# EAGLE design DigPSU1 (EAGLE 5.07)
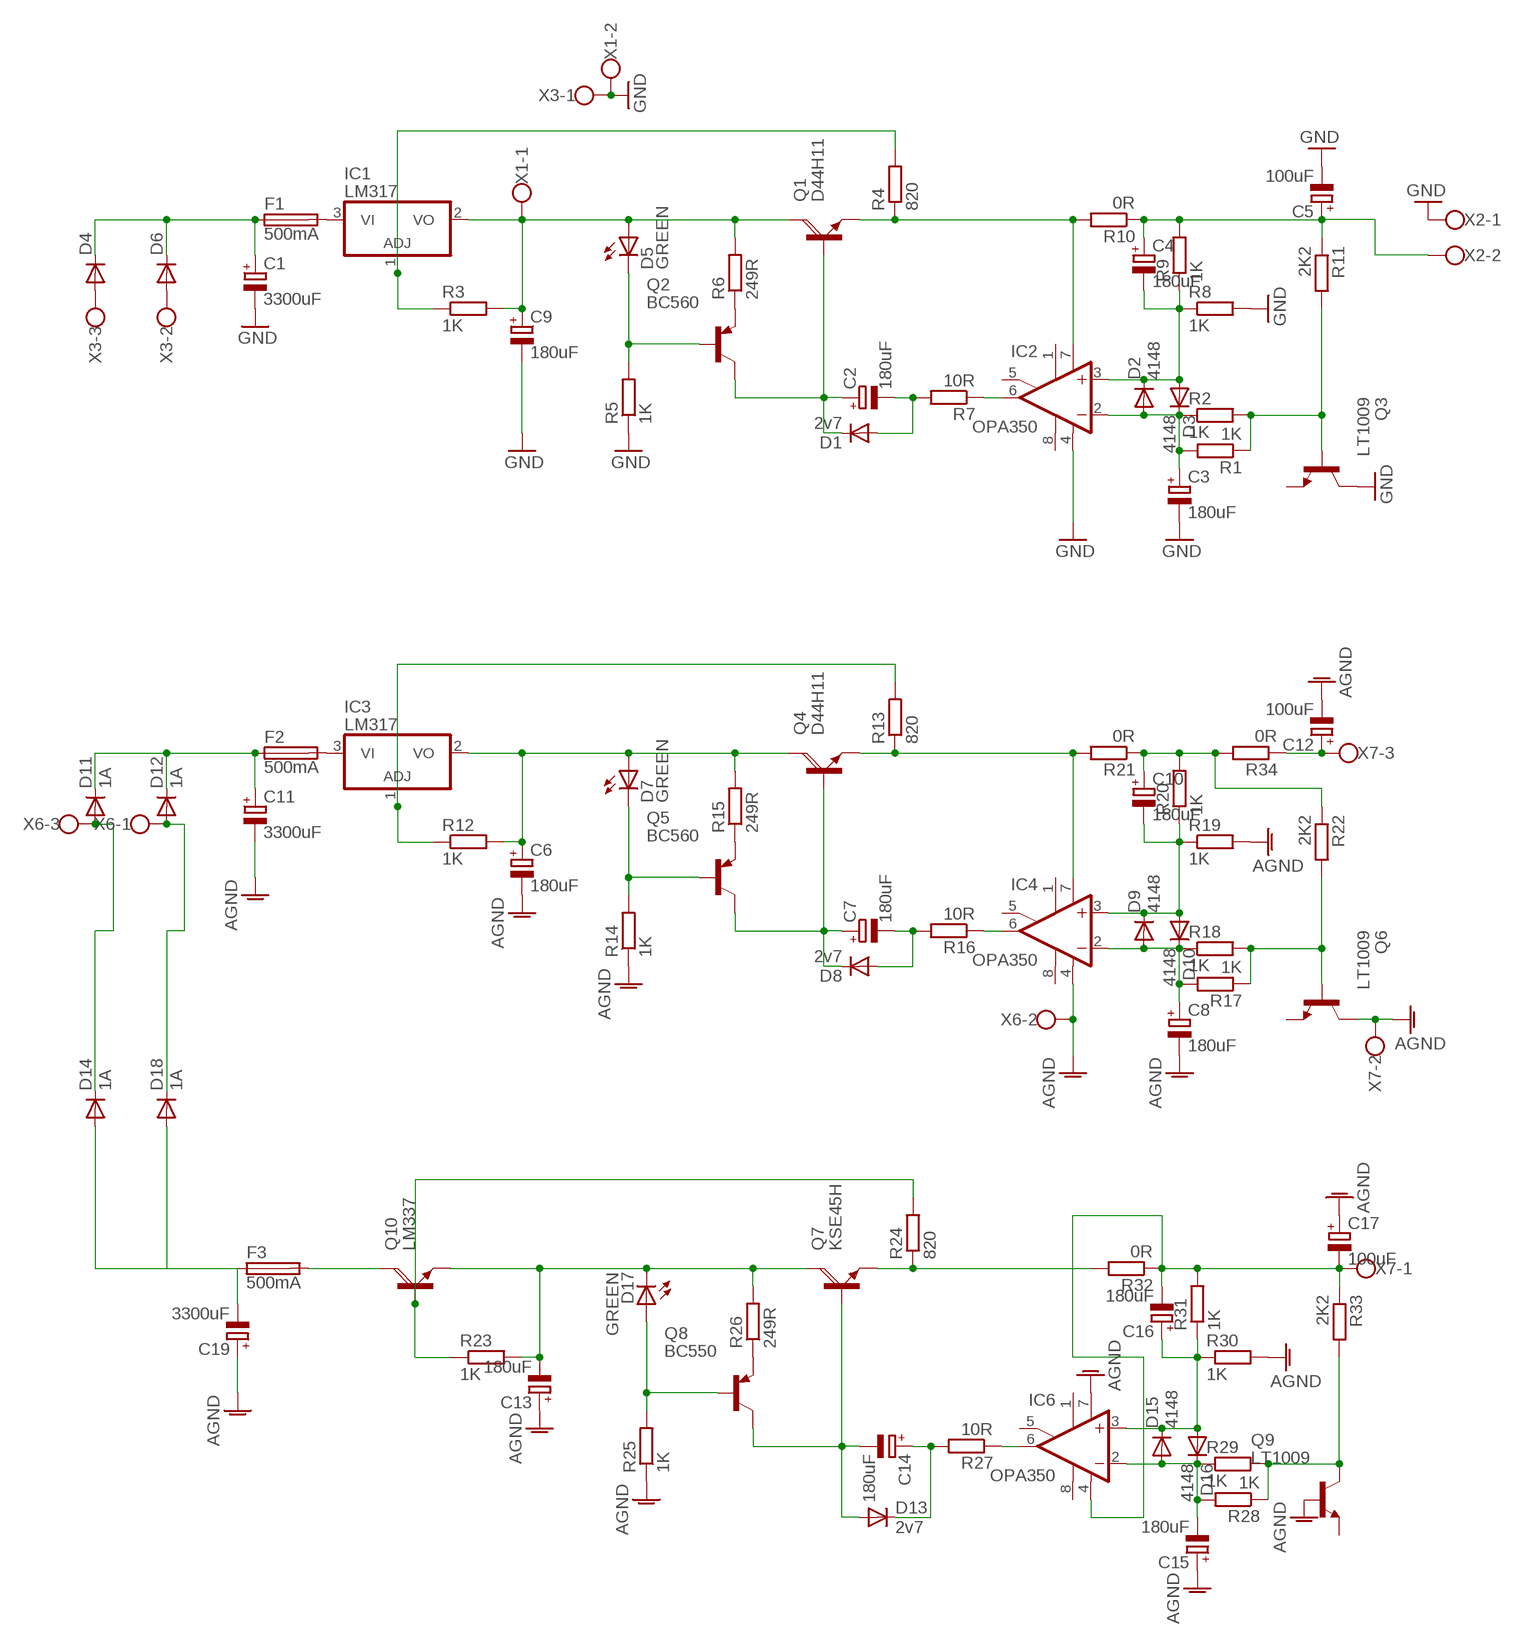
[diagram p0: schematic, sheet 1]

## Parts
C1  3300uF  CPOL-EUE7.5-16  [E7,5-16]
C2  180uF  CPOL-EUE3.5-8  [E3,5-8]
C3  180uF  CPOL-EUE3.5-8  [E3,5-8]
C4  180uF  CPOL-EUE3.5-8  [E3,5-8]
C5  100uF  CPOL-EUE5-10.5  [E5-10,5]
C6  180uF  CPOL-EUE3.5-8  [E3,5-8]
C7  180uF  CPOL-EUE3.5-8  [E3,5-8]
C8  180uF  CPOL-EUE3.5-8  [E3,5-8]
C9  180uF  CPOL-EUE3.5-8  [E3,5-8]
C10  180uF  CPOL-EUE3.5-8  [E3,5-8]
C11  3300uF  CPOL-EUE7.5-16  [E7,5-16]
C12  100uF  CPOL-EUE5-10.5  [E5-10,5]
C13  180uF  CPOL-EUE3.5-8  [E3,5-8]
C14  180uF  CPOL-EUE3.5-8  [E3,5-8]
C15  180uF  CPOL-EUE3.5-8  [E3,5-8]
C16  180uF  CPOL-EUE3.5-8  [E3,5-8]
C17  100uF  CPOL-EUE5-10.5  [E5-10,5]
C19  3300uF  CPOL-EUE7.5-16  [E7,5-16]
D1  2v7  1N4148DO35-7  [DO35-7]
D2  4148  1N4148DO35-10  [DO35-10]
D3  4148  1N4148DO35-10  [DO35-10]
D4  ES2D  [SMB]
D5  GREEN  SFH482  [SFH482]
D6  ES2D  [SMB]
D7  GREEN  SFH482  [SFH482]
D8  2v7  1N4148DO35-7  [DO35-7]
D9  4148  1N4148DO35-10  [DO35-10]
D10  4148  1N4148DO35-10  [DO35-10]
D11  1A  1N4148DO35-10  [DO35-10]
D12  1A  1N4148DO35-7  [DO35-7]
D13  2v7  1N4148DO35-7  [DO35-7]
D14  1A  1N4148DO35-10  [DO35-10]
D15  4148  1N4148DO35-10  [DO35-10]
D16  4148  1N4148DO35-10  [DO35-10]
D17  GREEN  SFH482  [SFH482]
D18  1A  1N4148DO35-7  [DO35-7]
F1  500mA  19560  [19560]
F2  500mA  19560  [19560]
F3  500mA  19560  [19560]
IC1  LM317  317T  [TO220H]
IC2  OPA350  LM741P  [DIL08]
IC3  LM317  317T  [TO220H]
IC4  OPA350  LM741P  [DIL08]
IC6  OPA350  LM741P  [DIL08]
Q1  D44H11  TIP120  [TO220AH]
Q2  BC560  [TO92-EBC]
Q3  LT1009  BC546A  [TO92-EBC]
Q4  D44H11  TIP120  [TO220AH]
Q5  BC560  [TO92-EBC]
Q6  LT1009  BC546A  [TO92-EBC]
Q7  KSE45H  TIP120  [TO220AH]
Q8  BC550  BC560  [TO92-EBC]
Q9  LT1009  BC546A  [TO92-EBC]
Q10  LM337  TIP120  [TO220AH]
R1  1K  R-EU_R1210  [R1210]
R2  1K  R-EU_R1210  [R1210]
R3  1K  R-EU_R1210  [R1210]
R4  820  R-EU_R1210  [R1210]
R5  1K  R-EU_R1210  [R1210]
R6  249R  R-EU_R1210  [R1210]
R7  10R  R-EU_R1210  [R1210]
R8  1K  R-EU_R1210  [R1210]
R9  1K  R-EU_R1210  [R1210]
R10  0R  R-EU_0204/7  [0204/7]
R11  2K2  R-EU_0204/7  [0204/7]
R12  1K  R-EU_R1210  [R1210]
R13  820  R-EU_R1210  [R1210]
R14  1K  R-EU_R1210  [R1210]
R15  249R  R-EU_R1210  [R1210]
R16  10R  R-EU_R1210  [R1210]
R17  1K  R-EU_R1210  [R1210]
R18  1K  R-EU_R1210  [R1210]
R19  1K  R-EU_R1210  [R1210]
R20  1K  R-EU_R1210  [R1210]
R21  0R  R-EU_0204/7  [0204/7]
R22  2K2  R-EU_0204/7  [0204/7]
R23  1K  R-EU_R1210  [R1210]
R24  820  R-EU_R1210  [R1210]
R25  1K  R-EU_R1210  [R1210]
R26  249R  R-EU_R1210  [R1210]
R27  10R  R-EU_R1210  [R1210]
R28  1K  R-EU_R1210  [R1210]
R29  1K  R-EU_R1210  [R1210]
R30  1K  R-EU_R1210  [R1210]
R31  1K  R-EU_R1210  [R1210]
R32  0R  R-EU_0204/7  [0204/7]
R33  2K2  R-EU_0204/7  [0204/7]
R34  0R  R-EU_0204/7  [0204/7]
X1  W237-02P  [W237-132]
X2  W237-02P  [W237-132]
X3  W237-3E  [W237-3E]
X6  W237-3E  [W237-3E]
X7  W237-3E  [W237-3E]

## Nets
AGND: C6.- C8.- C11.- C12.- C13.+ C15.+ C17.+ C19.+ IC4.4(V-) IC6.7(V+) Q6.C Q9.B R14.1 R19.2 R25.1 R30.2 X6.2 X7.2
GND: C1.- C3.- C5.- C9.- IC2.4(V-) Q3.C R5.1 R8.2 X1.2 X2.1 X3.1
N$1: F1.2 IC1.3(VI)
N$2: C4.- D2.C D3.A IC2.3(+IN) R8.1 R9.1
N$3: C3.+ D2.A D3.C IC2.2(-IN) R1.2 R2.1
N$4: Q3.B R1.1 R2.2 R11.2
N$5: IC1.1(ADJ) R3.1 R4.2
N$6: C4.+ C5.+ R9.2 R10.1 R11.1 X2.2
N$7: C9.+ D5.A IC1.2(VO) Q1.C R3.2 R6.2 X1.1
N$8: IC2.7(V+) Q1.E R4.1 R10.2
N$9: D5.K(C) Q2.B R5.2
N$10: Q2.E R6.1
N$11: C2.+ D1.C Q1.B Q2.C
N$12: C1.+ D4.C D6.C F1.1
N$13: IC2.6(OUT) R7.1
N$14: C2.- D1.A R7.2
N$15: D4.A X3.3
N$16: D6.A X3.2
N$17: IC3.1(ADJ) R12.1 R13.2
N$18: C6.+ D7.A IC3.2(VO) Q4.C R12.2 R15.2
N$19: IC4.7(V+) Q4.E R13.1 R21.2
N$20: D7.K(C) Q5.B R14.2
N$21: Q5.E R15.1
N$22: C7.+ D8.C Q4.B Q5.C
N$23: IC4.6(OUT) R16.1
N$24: C7.- D8.A R16.2
N$25: C10.- D9.C D10.A IC4.3(+IN) R19.1 R20.1
N$26: C8.+ D9.A D10.C IC4.2(-IN) R17.2 R18.1
N$27: Q6.B R17.1 R18.2 R22.2
N$28: C10.+ R20.2 R21.1 R22.1 R34.2
N$29: F2.2 IC3.3(VI)
N$30: C11.+ D11.C D12.C F2.1
N$31: D11.A D14.C X6.3
N$32: D12.A D18.C X6.1
N$33: Q10.B R23.1 R24.2
N$34: C13.- D17.K(C) Q7.C Q10.E R23.2 R26.2
N$35: C16.- C17.- IC6.4(V-) R31.2 R32.1 R33.1 X7.1
N$36: D17.A Q8.B R25.2
N$37: Q8.E R26.1
N$38: C14.- D13.A Q7.B Q8.C
N$39: IC6.6(OUT) R27.1
N$40: C14.+ D13.C R27.2
N$41: C16.+ D15.C D16.A IC6.3(+IN) R30.1 R31.1
N$42: C15.- D15.A D16.C IC6.2(-IN) R28.2 R29.1
N$43: Q9.C R28.1 R29.2 R33.2
N$44: F3.2 Q10.C
N$45: C12.+ R34.1 X7.3
N$46: C19.- D14.A D18.A F3.1
N$49: Q7.E R24.1 R32.2
Unconnected: IC2.1(ON1) IC2.5(ON2) IC2.8(OPT) IC4.1(ON1) IC4.5(ON2) IC4.8(OPT) IC6.1(ON1) IC6.5(ON2) IC6.8(OPT) Q3.E Q6.E Q9.E

## Library data of the parts
C1-C17 C19 = resistor:CPOL-EU: POLARIZED CAPACITOR, European symbol
D1-D3 D8-D16 D18 = diode:1N4148: DIODE high speed (Philips)
D4 D6 = diode:ES2D: DIODE super fast rectifier, 2 A
D5 D7 D17 = led:SFH482: IR LED infrared emitting diode, Infineon
F1-F3 = fuse:19560: FUSE HOLDER TR5, Wickmann
IC1 IC3 = linear:*317: Positive VOLTAGE REGULATOR
IC2 IC4 IC6 = linear:*741: OP AMP
Q1 Q4 Q7 Q10 = transistor-power:TIP120: NPN DARLINGTON TRANSISTOR
Q2 Q5 Q8 = transistor-pnp:BC560*: PNP Transistror
Q3 Q6 Q9 = transistor-npn:BC546*: NPN Transistor
R1-R34 = resistor:R-EU_: RESISTOR, European symbol
X1 X2 = con-wago-508:W237-02P: WAGO SREW CLAMP
X3 X6 X7 = con-wago-508:W237-3E: WAGO SREW CLAMP

## Board
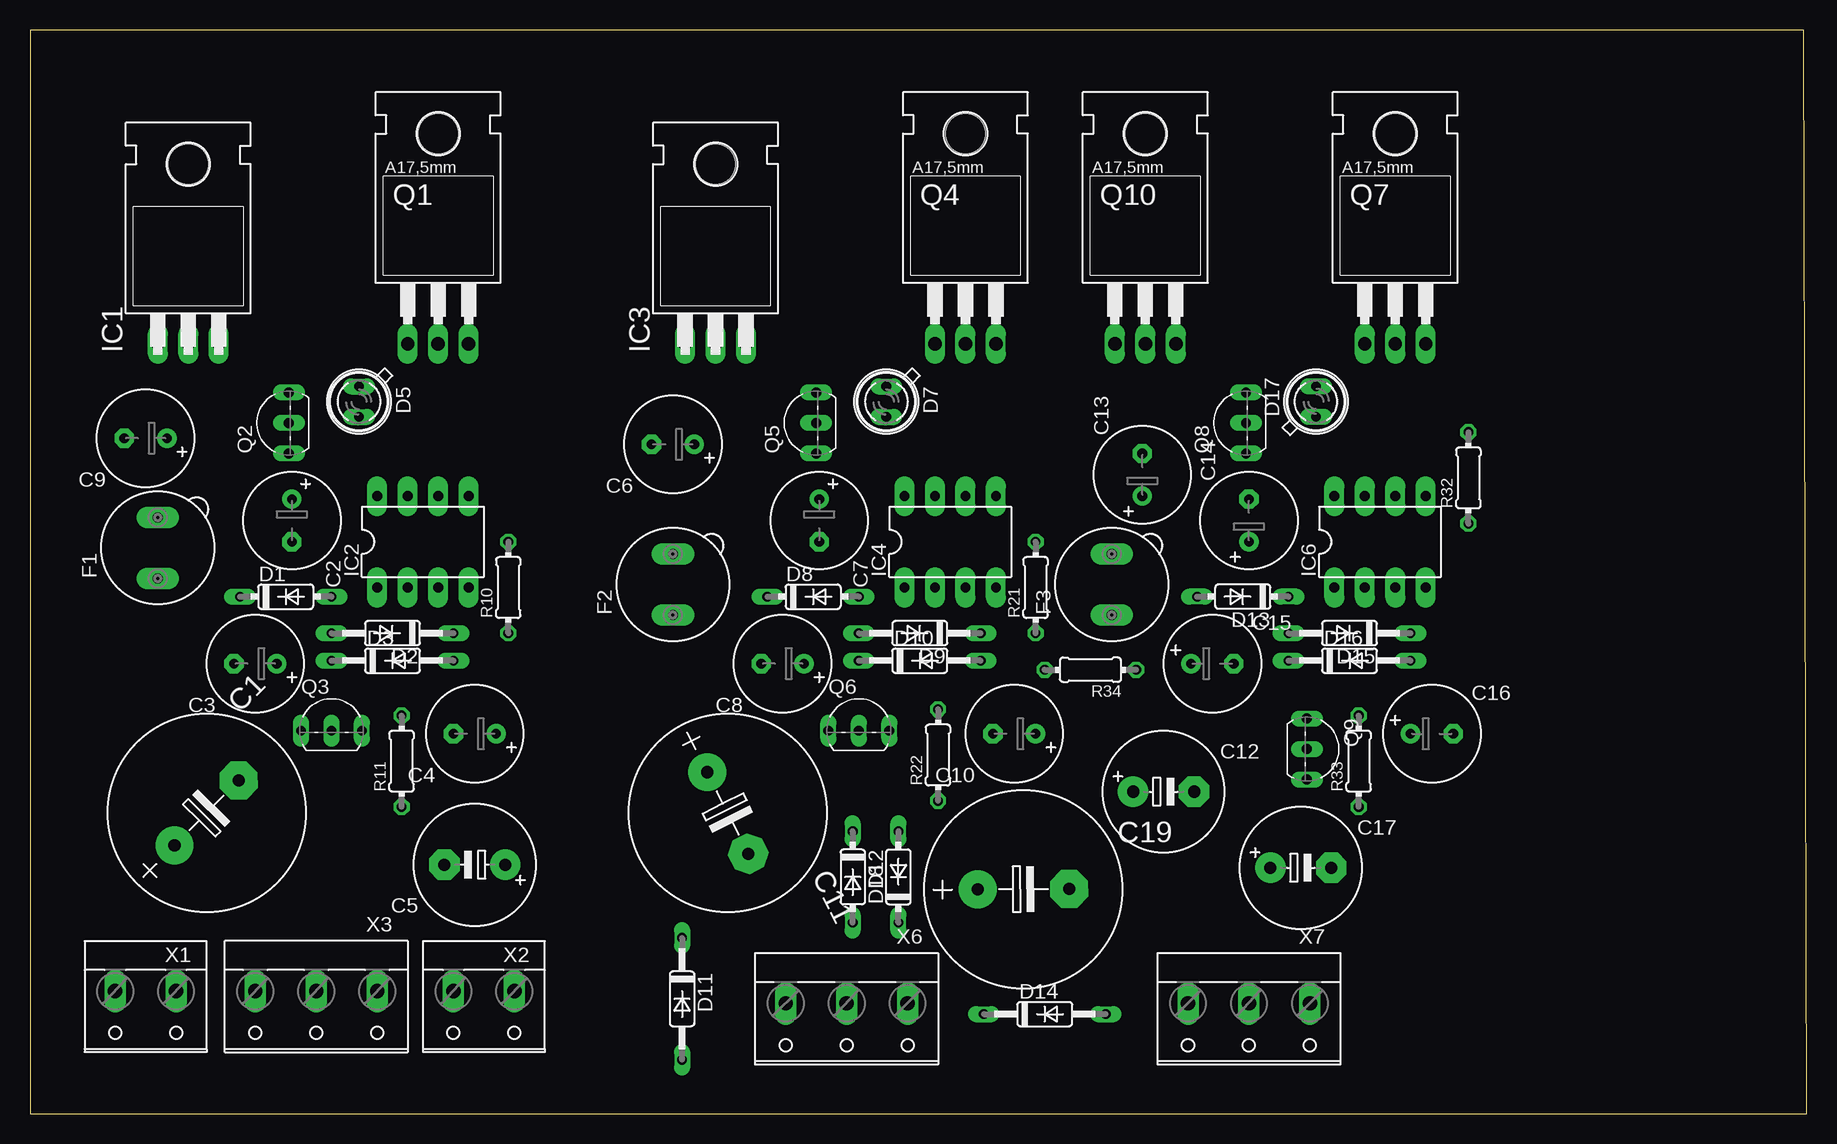
[diagram p1: board, top side]
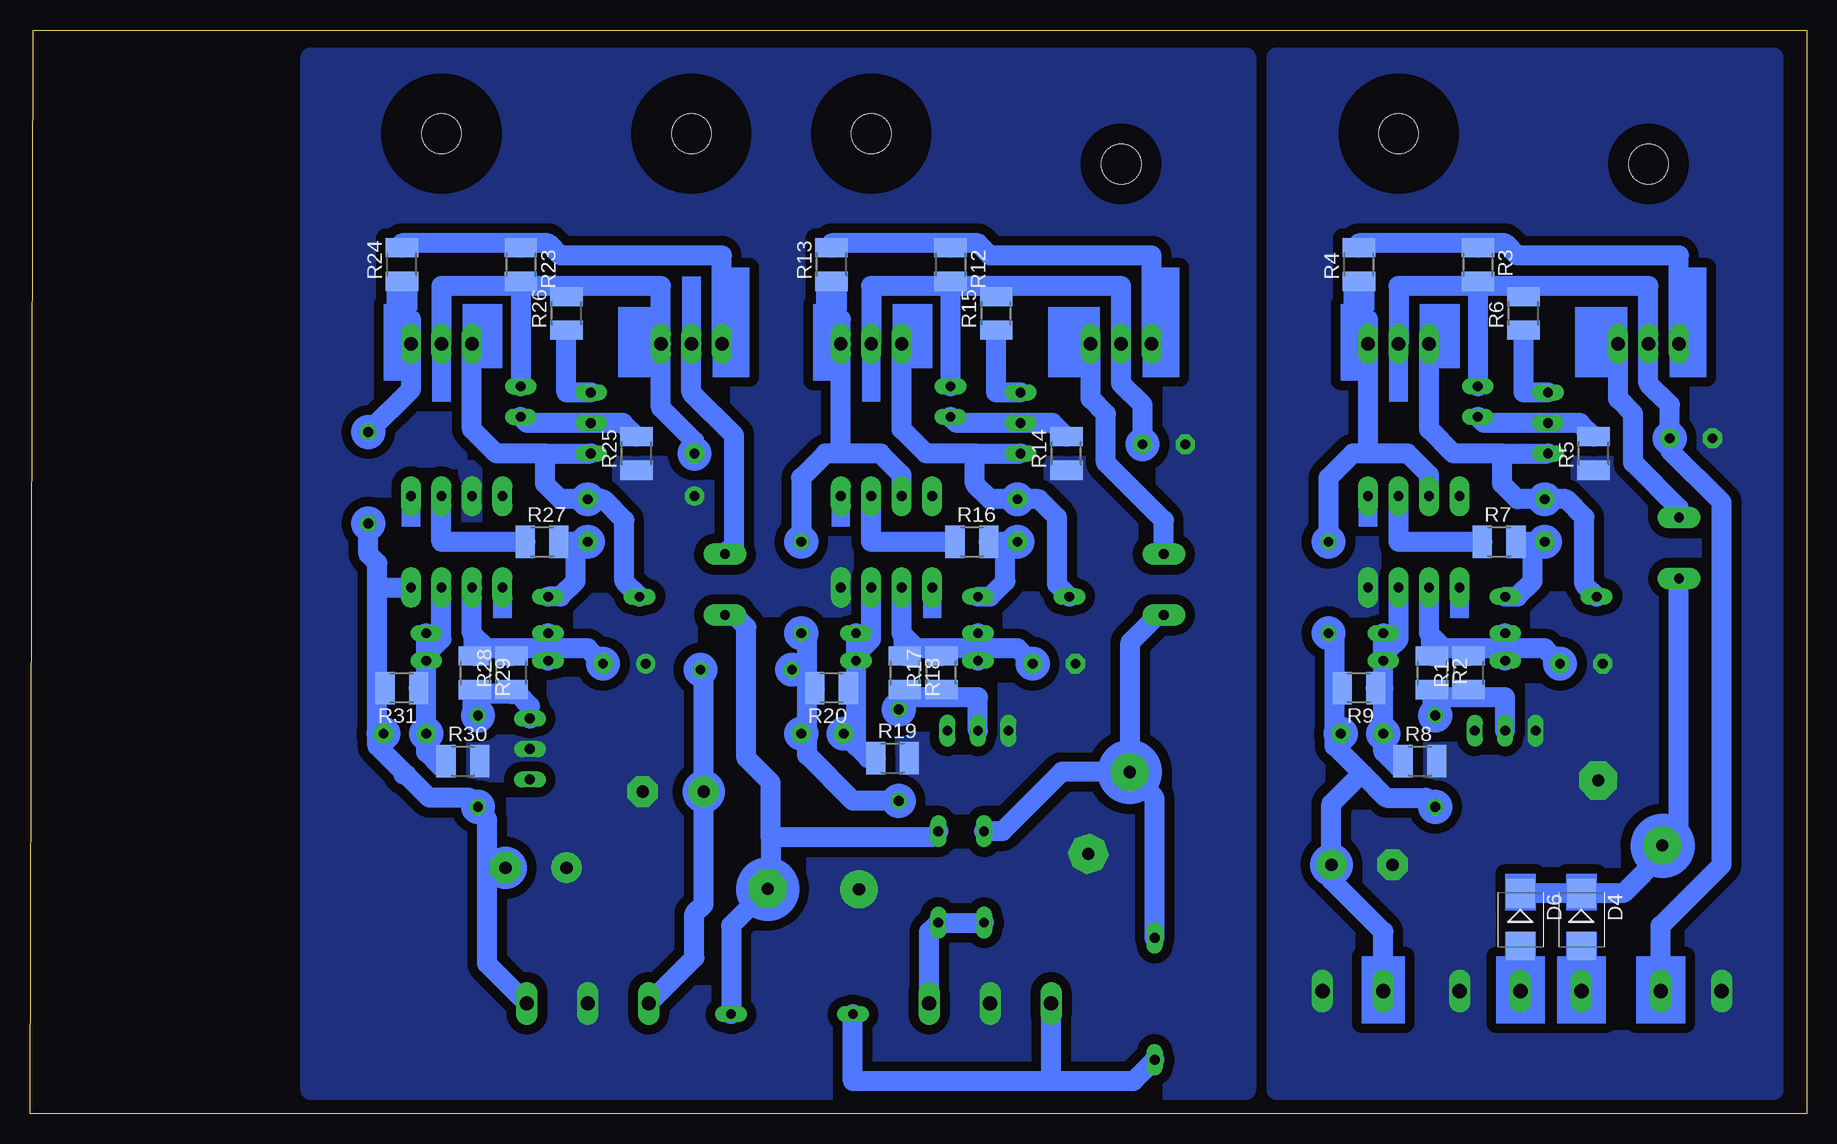
[diagram p2: board, bottom side, seen from below]

Size 148.06 x 90.35 mm. Coordinates in mm from the lower left corner, seen from the top.
Outline: 147.81,90.35 0,90.35 0,0 148.06,0 147.81,90.35
Copper layers (1*16): Top 0.035mm / dielectric 1.5mm / Bottom 0.035mm
Design rules "default *": minimum track width 10mil, minimum drill 24mil, track to track 8mil, track to pad 8mil, pad to pad 8mil, via to via 8mil, smd to smd 8mil, copper to edge 40mil, drill to drill 8mil, minimum pad ring 10mil, minimum via ring 8mil, stop-mask expansion 4mil, vias tented up to drill 0mil, thermal gap 10mil

### Footprints (pad centres in the part's own frame; a part is rotated, then mirrored left to right if it is on the bottom)
E7,5-16 = drill 1.016 pad 3.15 round: + -3.81,0 | drill 1.016 pad 3.15 octagon: - 3.81,0
E3,5-8 = drill 0.813 pad 1.6 round: + -1.778,0 | drill 0.813 pad 1.6 octagon: - 1.778,0
E5-10,5 = drill 1.016 pad 2.54 round: + -2.54,0 | drill 1.016 pad 2.54 octagon: - 2.54,0
DO35-7 = drill 0.813 long: A 3.81,0; C -3.81,0
DO35-10 = drill 0.813 long: A 5.08,0; C -5.08,0
SMB = smd 2.4 x 2.4: A 2.2,0; C -2.2,0
SFH482 = drill 0.813 long: A -1.27,0; K 1.27,0
19560 = drill 0.813 pad 1.778 long: 1 -2.54,0; 2 2.54,0
TO220H = drill 1.118 long: 1 -2.54,-10.16; 2 0,-10.16; 3 2.54,-10.16 | hole 3.302: 0,4.826
DIL08 = drill 0.813 pad 1.676 long: 1 -3.81,-3.81; 2 -1.27,-3.81; 3 1.27,-3.81; 4 3.81,-3.81; 5 3.81,3.81; 6 1.27,3.81; 7 -1.27,3.81; 8 -3.81,3.81
TO220AH = drill 1.118 long: B -2.54,-6.35; C 0,-6.35; E 2.54,-6.35 | hole 3.302: 0,11.176
TO92-EBC = drill 0.813 long: B 0,-1.27; C -2.54,-1.27; E 2.54,-1.27
R1210 = smd 1.6 x 2.7: 1 -1.4,0; 2 1.4,0
0204/7 = drill 0.813 octagon: 1 -3.81,0; 2 3.81,0
W237-132 = drill 1.194 long: 1 -2.54,-0.635; 2 2.54,-0.635
W237-3E = drill 1.194 long: 1 -5.08,-0.635; 2 0,-0.635; 3 5.08,-0.635

### Placement (x,y rotation side)
C1  14.71,25.07 45.4 top
C2  21.82,49.45 270 top
C3  18.78,37.52 180 top
C4  37.06,31.67 180 top
C5  37.06,20.75 180 top
C6  53.57,55.8 180 top
C7  65.77,49.45 270 top
C8  62.72,37.52 180 top
C9  9.63,56.31 180 top
C10  82.02,31.67 180 top
C11  58.15,25.07 296.8 top
C12  94.47,26.85 0 top
C13  92.69,53.26 90 top
C14  101.58,49.45 90 top
C15  98.53,37.52 0 top
C16  116.82,31.67 0 top
C17  105.9,20.5 0 top
C19  82.78,18.72 0.4 top
D1  21.32,43.1 0 top
D2  30.21,40.06 180 top
D3  30.21,37.77 0 top
D4  18.78,16.18 270 bottom
D5  27.41,59.36 270 top
D6  23.86,16.18 270 bottom
D7  71.35,59.36 270 top
D8  65.26,43.1 0 top
D9  74.15,40.06 180 top
D10  74.15,37.77 0 top
D11  54.34,9.58 270 top
D12  68.56,19.74 270 top
D13  101.07,43.1 180 top
D14  84.56,8.31 0 top
D15  109.96,40.06 180 top
D16  109.96,37.77 0 top
D17  107.17,59.36 90 top
D18  72.37,19.74 90 top
F1  10.65,47.17 90 top
F2  53.57,44.12 90 top
F3  90.15,44.12 90 top
IC1  13.19,74.35 0 top
IC2  32.75,47.68 0 top
IC3  57.13,74.35 0 top
IC4  76.69,47.68 0 top
IC6  112.5,47.68 0 top
Q1  34.02,70.54 0 top
Q2  20.3,57.58 90 top
Q3  25.13,33.2 0 top
Q4  77.96,70.54 0 top
Q5  64.24,57.58 90 top
Q6  69.07,33.2 0 top
Q7  113.77,70.54 0 top
Q8  100.06,57.58 90 top
Q9  107.68,30.4 270 top
Q10  92.94,70.54 0 top
R1  28.17,36.75 90 bottom
R2  31.22,36.75 270 bottom
R3  27.41,70.79 270 bottom
R4  37.32,70.79 90 bottom
R5  17.76,55.04 90 bottom
R6  23.6,66.73 90 bottom
R7  25.63,47.68 0 bottom
R8  32.24,29.39 0 bottom
R9  37.32,35.48 180 bottom
R10  39.86,43.87 90 top
R11  30.97,29.39 90 top
R12  71.35,70.79 270 bottom
R13  81.26,70.79 90 bottom
R14  61.7,55.04 90 bottom
R15  67.54,66.73 90 bottom
R16  69.58,47.68 0 bottom
R17  72.12,36.75 90 bottom
R18  75.16,36.75 270 bottom
R19  76.18,29.64 0 bottom
R20  81.26,35.48 180 bottom
R21  83.8,43.87 90 top
R22  75.67,29.9 90 top
R23  107.17,70.79 270 bottom
R24  117.07,70.79 90 bottom
R25  97.52,55.04 90 bottom
R26  103.36,66.73 90 bottom
R27  105.39,47.68 0 bottom
R28  107.93,36.75 90 bottom
R29  110.98,36.75 270 bottom
R30  111.99,29.39 0 bottom
R31  117.07,35.48 180 bottom
R32  119.87,53.01 90 top
R33  110.72,29.39 90 top
R34  88.37,37.01 180 top
X1  9.63,9.58 180 top
X2  37.83,9.58 180 top
X3  23.86,9.58 180 top
X6  68.05,8.56 180 top
X7  101.58,8.56 180 top

### Tracks (layer width: path | path; a pad name or v marks a point on that pad's centre or on a via)
AGND
  pour Bottom (isolate 0.813, no thermals): 46.72,88.06 46.72,1.96 124.69,1.96 124.69,88.06
GND
  pour Bottom (isolate 0.813, no thermals): 2.77,88.06 2.77,1.96 44.18,1.96 44.18,88.06
N$1
  Bottom 1.676: IC1.3 15.73,59.61 14.46,58.34 14.46,54.28 10.65,50.47 F1.2
N$2
  Bottom 1.676: 35.29,38.79 D2.C | 35.29,38.79 D3.A 35.29,35.48 | 35.29,38.79 34.78,38.79 34.02,39.55 IC2.3 | 35.29,35.48 R9.1 | R8.1 34.02,28.88 35.29,30.15 C4.- 35.29,35.48
N$3
  Bottom 1.676: 25.13,38.79 D3.C | 25.13,38.79 D2.A | 25.13,38.79 28.17,38.79 | 28.17,38.79 30.21,38.79 31.35,39.93 | IC2.2 31.48,40.06 31.35,39.93 | C3.+ 21.82,38.79 25.13,38.79 | 28.17,38.79 R1.2 | R2.1 31.35,38.28 31.35,39.93
N$4
  Bottom 1.676: 28.17,34.72 30.97,34.72 | 30.97,34.72 31.22,34.72 31.22,33.45 R11.2 | 28.17,34.72 R1.1 | 30.97,34.72 R2.2 | 28.17,34.72 25.13,34.72 Q3.B
N$5
  Bottom 1.676: R4.2 37.32,72.57 27.41,72.57 | 27.41,72.57 R3.1 | 27.41,72.57 25.13,72.57 24.11,71.55 10.65,71.55 IC1.1
N$6
  Bottom 1.676: R10.1 39.35,39.55 39.35,35.23 | R9.2 38.97,35.23 39.35,35.23 | 39.35,32.18 C4.+ | 39.35,32.18 39.35,35.23 | 39.35,32.18 39.35,30.66 36.94,28.25 | R11.1 31.73,26.34 35.03,26.34 36.94,28.25 | 36.94,28.25 37.19,28.25 39.6,25.83 C5.+ 39.6,19.48 35.29,15.16 X2.2
N$7
  Bottom 1.676: 23.35,69.01 13.19,69.01 IC1.2 13.19,60.88 11.41,59.11 C9.+ 11.41,55.3 7.09,50.98 7.09,20.75 12.17,15.67 X1.1 | 23.35,69.01 27.41,69.01 | 27.41,69.01 34.02,69.01 Q1.C | 23.35,69.01 R6.2 | 27.41,69.01 R3.2 D5.A
N$8
  Bottom 1.676: R4.1 37.32,66.98 36.56,66.22 Q1.E 36.56,55.04 | IC2.7 31.48,53.26 33.25,55.04 36.56,55.04 | 36.56,55.04 37.83,55.04 39.86,53.01 R10.2
N$9
  Bottom 1.676: D5.K 26.9,57.58 Q2.B 18.9,57.58 R5.2
N$10
  Bottom 1.676: Q2.E 23.6,60.12 R6.1
N$11
  Bottom 1.676: 25.38,55.04 Q2.C | 25.38,55.04 29.44,55.04 31.48,57.07 Q1.B | 25.38,55.04 25.38,52.5 24.11,51.23 C2.+ 20.05,51.23 18.52,49.71 18.52,44.12 D1.C
N$12
  Bottom 1.676: D6.C D4.C 15.31,18.38 11.92,21.77 11.92,22.24 C1.+ 10.65,23.75 F1.1
N$13
  Bottom 1.676: R7.1 34.02,47.68 IC2.6
N$14
  Bottom 1.676: 22.84,47.68 C2.- | 22.84,47.68 R7.2 | D1.A 24.11,43.1 22.84,44.37 22.84,47.68
N$15
  Bottom 1.676: X3.3 D4.A
N$16
  Bottom 1.676: D6.A X3.2 23.86,9.58
N$17
  Bottom 1.676: R13.2 81.26,72.57 71.35,72.57 | 71.35,72.57 R12.1 | 71.35,72.57 69.07,72.57 68.05,71.55 54.59,71.55 IC3.1
N$18
  Bottom 1.676: 67.29,69.01 57.13,69.01 IC3.2 57.13,60.88 55.35,59.11 C6.+ | 67.29,69.01 71.35,69.01 | 71.35,69.01 77.96,69.01 Q4.C | 67.29,69.01 R15.2 | 71.35,69.01 R12.2 D7.A
N$19
  Bottom 1.676: R13.1 81.26,66.98 80.5,66.22 Q4.E 80.5,55.04 | IC4.7 75.42,53.26 77.2,55.04 80.5,55.04 | 80.5,55.04 81.77,55.04 83.8,53.01 R21.2
N$20
  Bottom 1.676: D7.K 70.85,57.58 Q5.B 62.84,57.58 R14.2
N$21
  Bottom 1.676: Q5.E 67.54,60.12 R15.1
N$22
  Bottom 1.676: 69.32,55.04 Q5.C | 69.32,55.04 73.39,55.04 75.42,57.07 Q4.B | 69.32,55.04 69.32,52.5 68.05,51.23 C7.+ 63.99,51.23 62.46,49.71 62.46,44.12 D8.C
N$23
  Bottom 1.676: R16.1 77.96,47.68 IC4.6
N$24
  Bottom 1.676: 66.78,47.68 C7.- | 66.78,47.68 R16.2 | D8.A 68.05,43.1 66.78,44.37 66.78,47.68
N$25
  Bottom 1.676: 79.23,38.79 D9.C | 79.23,38.79 D10.A 79.23,35.48 | 79.23,38.79 78.72,38.79 77.96,39.55 IC4.3 | 79.23,35.48 R20.1 | R19.1 78.21,29.64 79.23,30.66 | 79.23,30.66 C10.- | 79.23,30.66 79.23,35.48
N$26
  Bottom 1.676: 69.07,38.79 D10.C | 69.07,38.79 D9.A | 69.07,38.79 72.12,38.79 | 72.12,38.79 74.15,38.79 75.29,39.93 | IC4.2 75.42,40.06 75.29,39.93 | C8.+ 65.77,38.79 69.07,38.79 | 72.12,38.79 R17.2 | R18.1 75.29,38.28 75.29,39.93
N$27
  Bottom 1.676: 72.12,34.72 74.91,34.72 | 74.91,34.72 75.16,34.72 75.16,33.45 R22.2 | 72.12,34.72 R17.1 | 74.91,34.72 R18.2 | 72.12,34.72 69.07,34.72 Q6.B
N$28
  Bottom 1.676: R21.1 83.29,39.55 83.29,37.01 | 83.29,35.23 83.29,37.01 | R20.2 82.91,35.23 83.29,35.23 | 83.29,32.18 C10.+ | 83.29,32.18 83.29,35.23 | 83.29,32.18 83.29,29.9 79.48,26.09 R22.1 | 83.29,37.01 R34.2
N$29
  Bottom 1.676: IC3.3 59.67,59.61 58.4,58.34 58.4,54.28 53.57,49.45 F2.2
N$30
  Bottom 1.676: D12.C 67.04,23.55 62.07,28.51 56.53,28.51 C11.+ | C11.+ 56.37,29.05 56.37,39.29 54.08,41.58 F2.1 | C11.+ 54.34,26.31 D11.C
N$31
  Bottom 1.676: 62.97,2.72 X6.3 | 62.97,2.72 79.48,2.72 D14.C | D11.A 56.11,2.72 62.97,2.72
N$32
  Bottom 1.676: D12.A D18.C 73.13,15.16 X6.1
N$33
  Bottom 1.676: R24.2 117.07,72.57 107.17,72.57 | 106.91,72.57 104.88,72.57 103.87,71.55 90.4,71.55 Q10.B | 106.91,72.57 107.17,72.57 | 106.91,72.57 106.91,72.44 | 107.17,72.57 R23.1
N$34
  Bottom 1.676: 103.1,69.01 107.17,69.01 | 107.17,69.01 113.77,69.01 Q7.C | 103.1,69.01 R26.2 | 107.17,69.01 R23.2 D17.K | C13.- 92.69,56.06 95.48,58.85 Q10.E 95.48,69.01 103.1,69.01
N$35
  Bottom 1.676: R31.2 118.73,35.23 119.11,35.23 | 119.11,31.67 119.11,30.66 116.69,28.25 | 119.11,31.67 119.11,35.23 | 116.69,28.25 114.79,26.34 111.49,26.34 R33.1 110.72,25.32 109.96,24.56 109.96,21.01 109.96,20.24 | 116.69,28.25 116.95,28.25 | 119.11,31.67 C16.- | R32.1 119.87,46.66 119.11,45.9 119.11,43.87 | 119.11,35.23 119.11,43.87 | 119.11,43.87 IC6.4 | C17.- 108.69,20.24 109.96,20.24 | X7.1 109.96,12.5 109.96,20.24
N$36
  Bottom 1.676: R25.2 98.66,57.58 Q8.B 106.66,57.58 D17.A
N$37
  Bottom 1.676: Q8.E 103.36,60.12 R26.1
N$38
  Bottom 1.676: 105.14,55.04 Q8.C | 105.14,55.04 109.2,55.04 111.23,57.07 Q7.B | 105.14,55.04 105.14,52.5 103.87,51.23 C14.- 100.31,51.23 98.53,49.45 98.53,44.37 D13.A
N$39
  Bottom 1.676: R27.1 113.77,47.68 IC6.6
N$40
  Bottom 1.676: 102.6,47.68 R27.2 | 102.6,47.68 102.6,44.37 103.87,43.1 D13.C | 102.6,47.68 C14.+
N$41
  Bottom 1.676: 115.04,38.79 D15.C | 115.04,38.79 D16.A 115.04,35.48 | 115.04,38.79 114.53,38.79 113.77,39.55 IC6.3 | 115.04,35.48 R31.1 | R30.1 113.77,28.88 115.04,30.15 C16.+ 115.04,35.48
N$42
  Bottom 1.676: 104.88,38.79 D16.C | 104.88,38.79 D15.A | 104.88,38.79 107.93,38.79 | 107.93,38.79 109.96,38.79 111.11,39.93 | IC6.2 111.23,40.06 111.11,39.93 | 104.88,38.79 101.58,38.79 C15.- | 107.93,38.79 R28.2 | R29.1 111.11,38.28 111.11,39.93
N$43
  Bottom 1.676: Q9.C 106.41,33.96 107.42,34.98 107.93,34.98 | 107.93,34.98 110.47,34.98 110.6,34.85 | 110.6,34.85 110.72,34.72 R33.2 | 107.93,34.98 R28.1 | R29.2 110.6,34.97 110.6,34.85
N$44
  Bottom 1.676: F3.2 89.39,47.42 89.39,56.57 92.94,60.12 Q10.C
N$45
  Bottom 1.676: X7.3 92.69,13 92.69,16.69 91.93,17.45 C12.+ 91.93,36.75 R34.1
N$46
  Bottom 1.676: D14.A 89.64,15.7 C19.- 86.34,19 86.34,23.04 | 86.34,23.04 86.34,27.61 88.37,29.64 88.37,40.56 89.39,41.58 F3.1 | D18.A 72.88,23.04 86.34,23.04
N$49
  Bottom 1.676: R24.1 117.07,66.98 116.31,66.22 Q7.E 116.31,60.38 R32.2
(copper drawn outside any net)
  shapes: Bottom area x49, Bottom circle x50